# EAGLE schematic microsal (EAGLE 8.2.2)

## Sheet 1 of 2
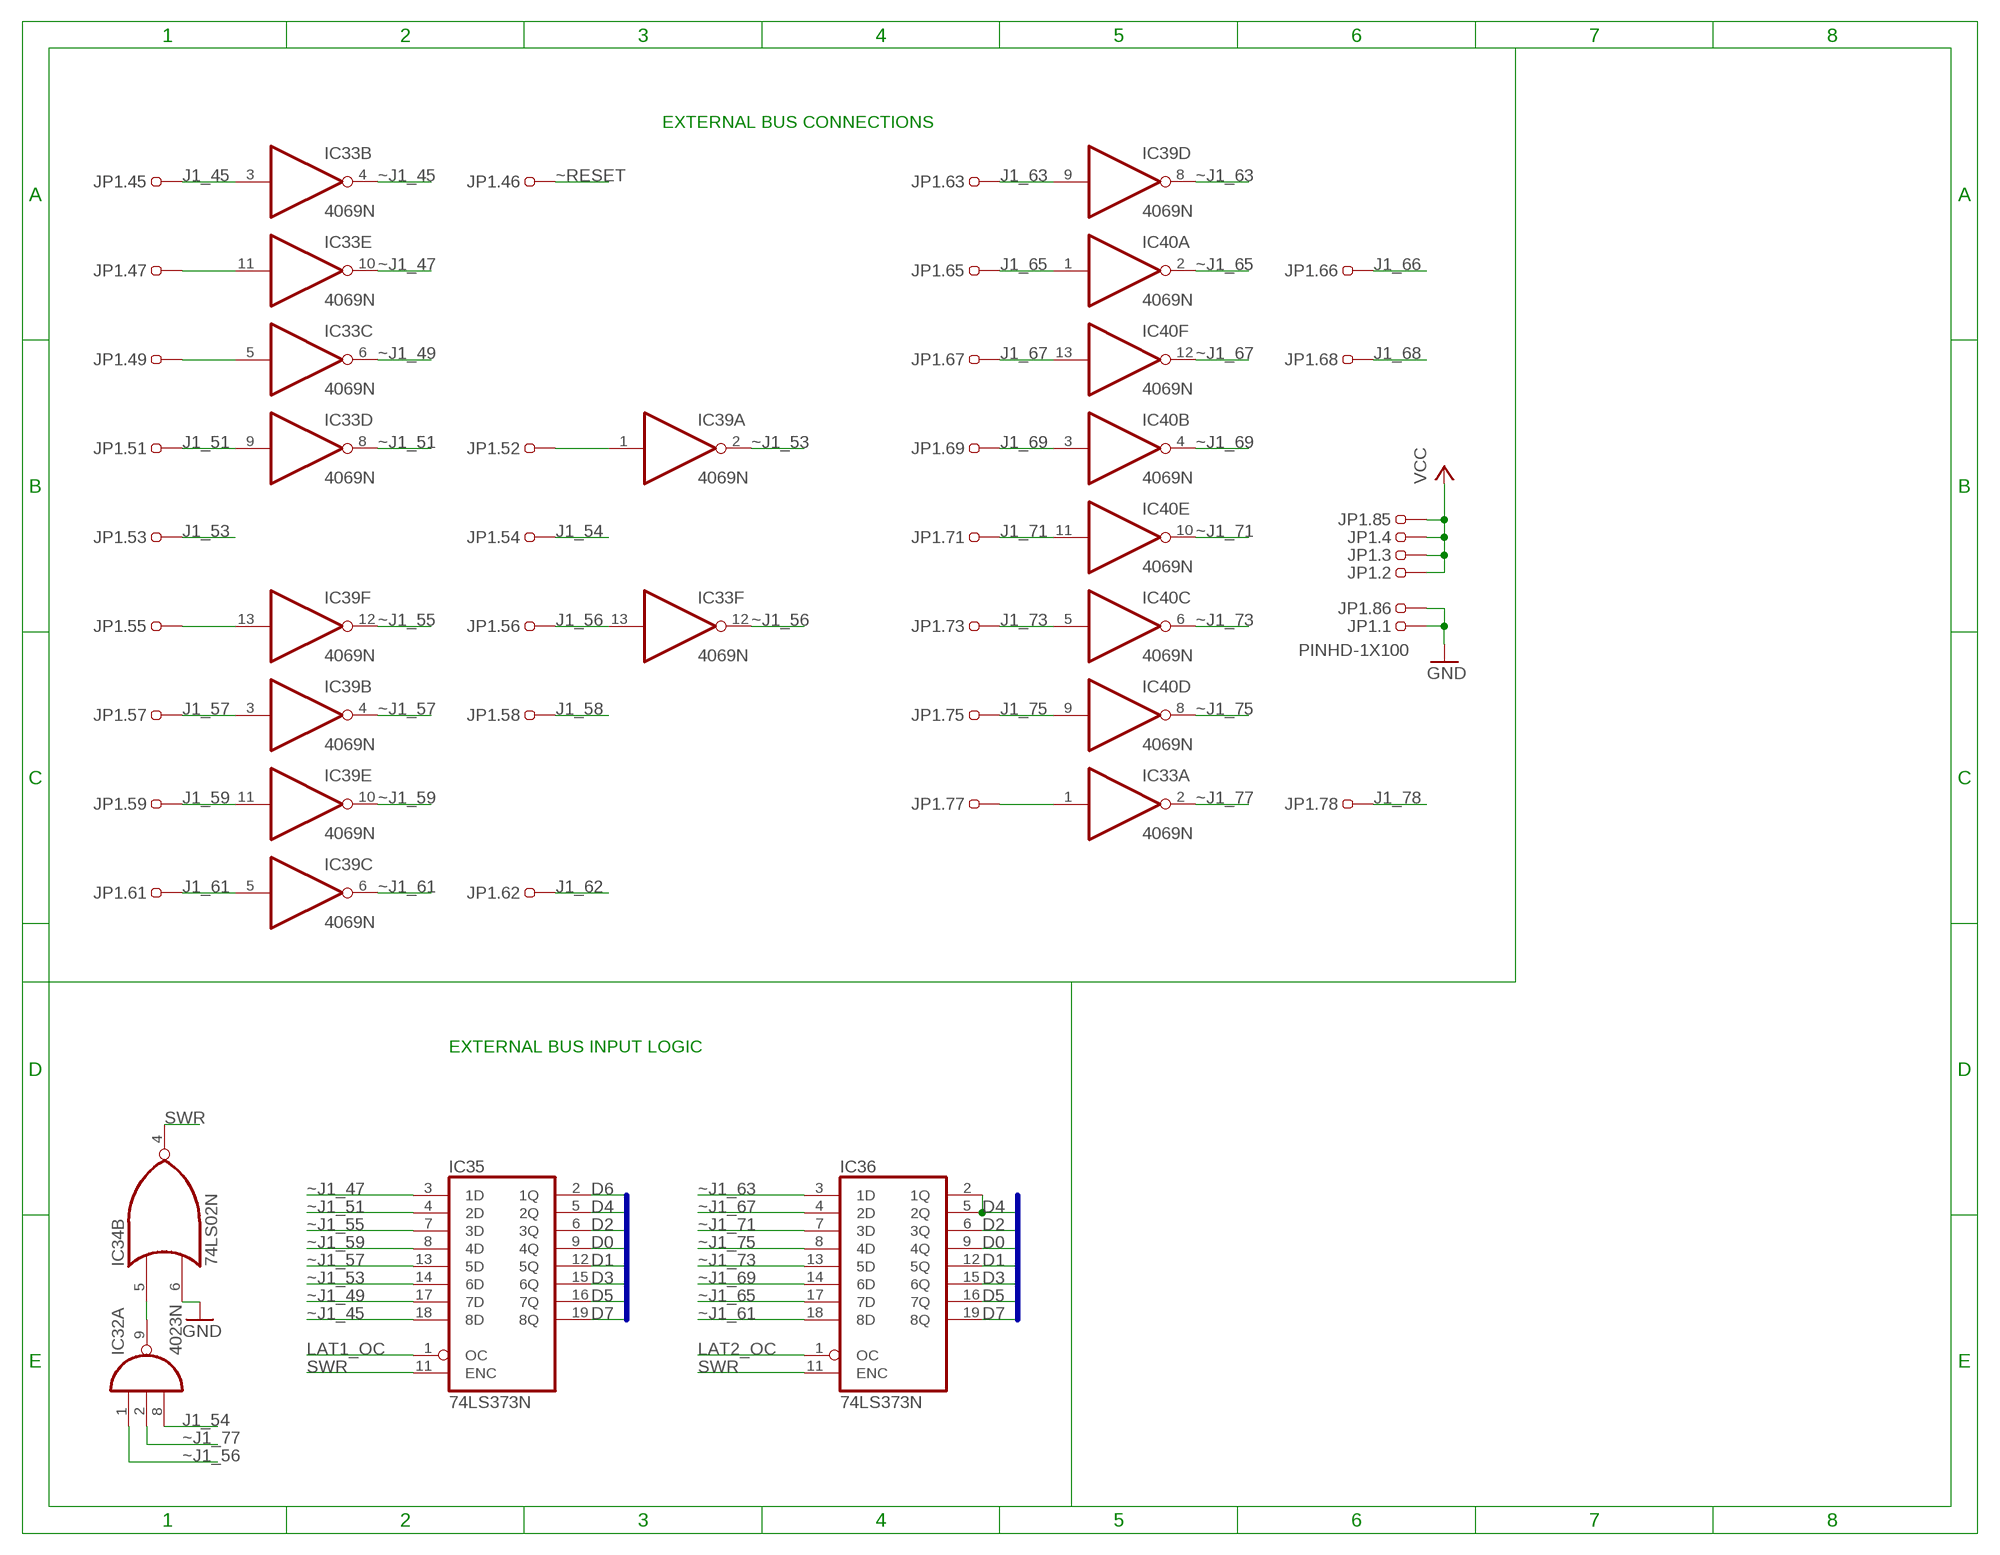
[diagram p0: schematic, sheet 1, part 1 of 2]
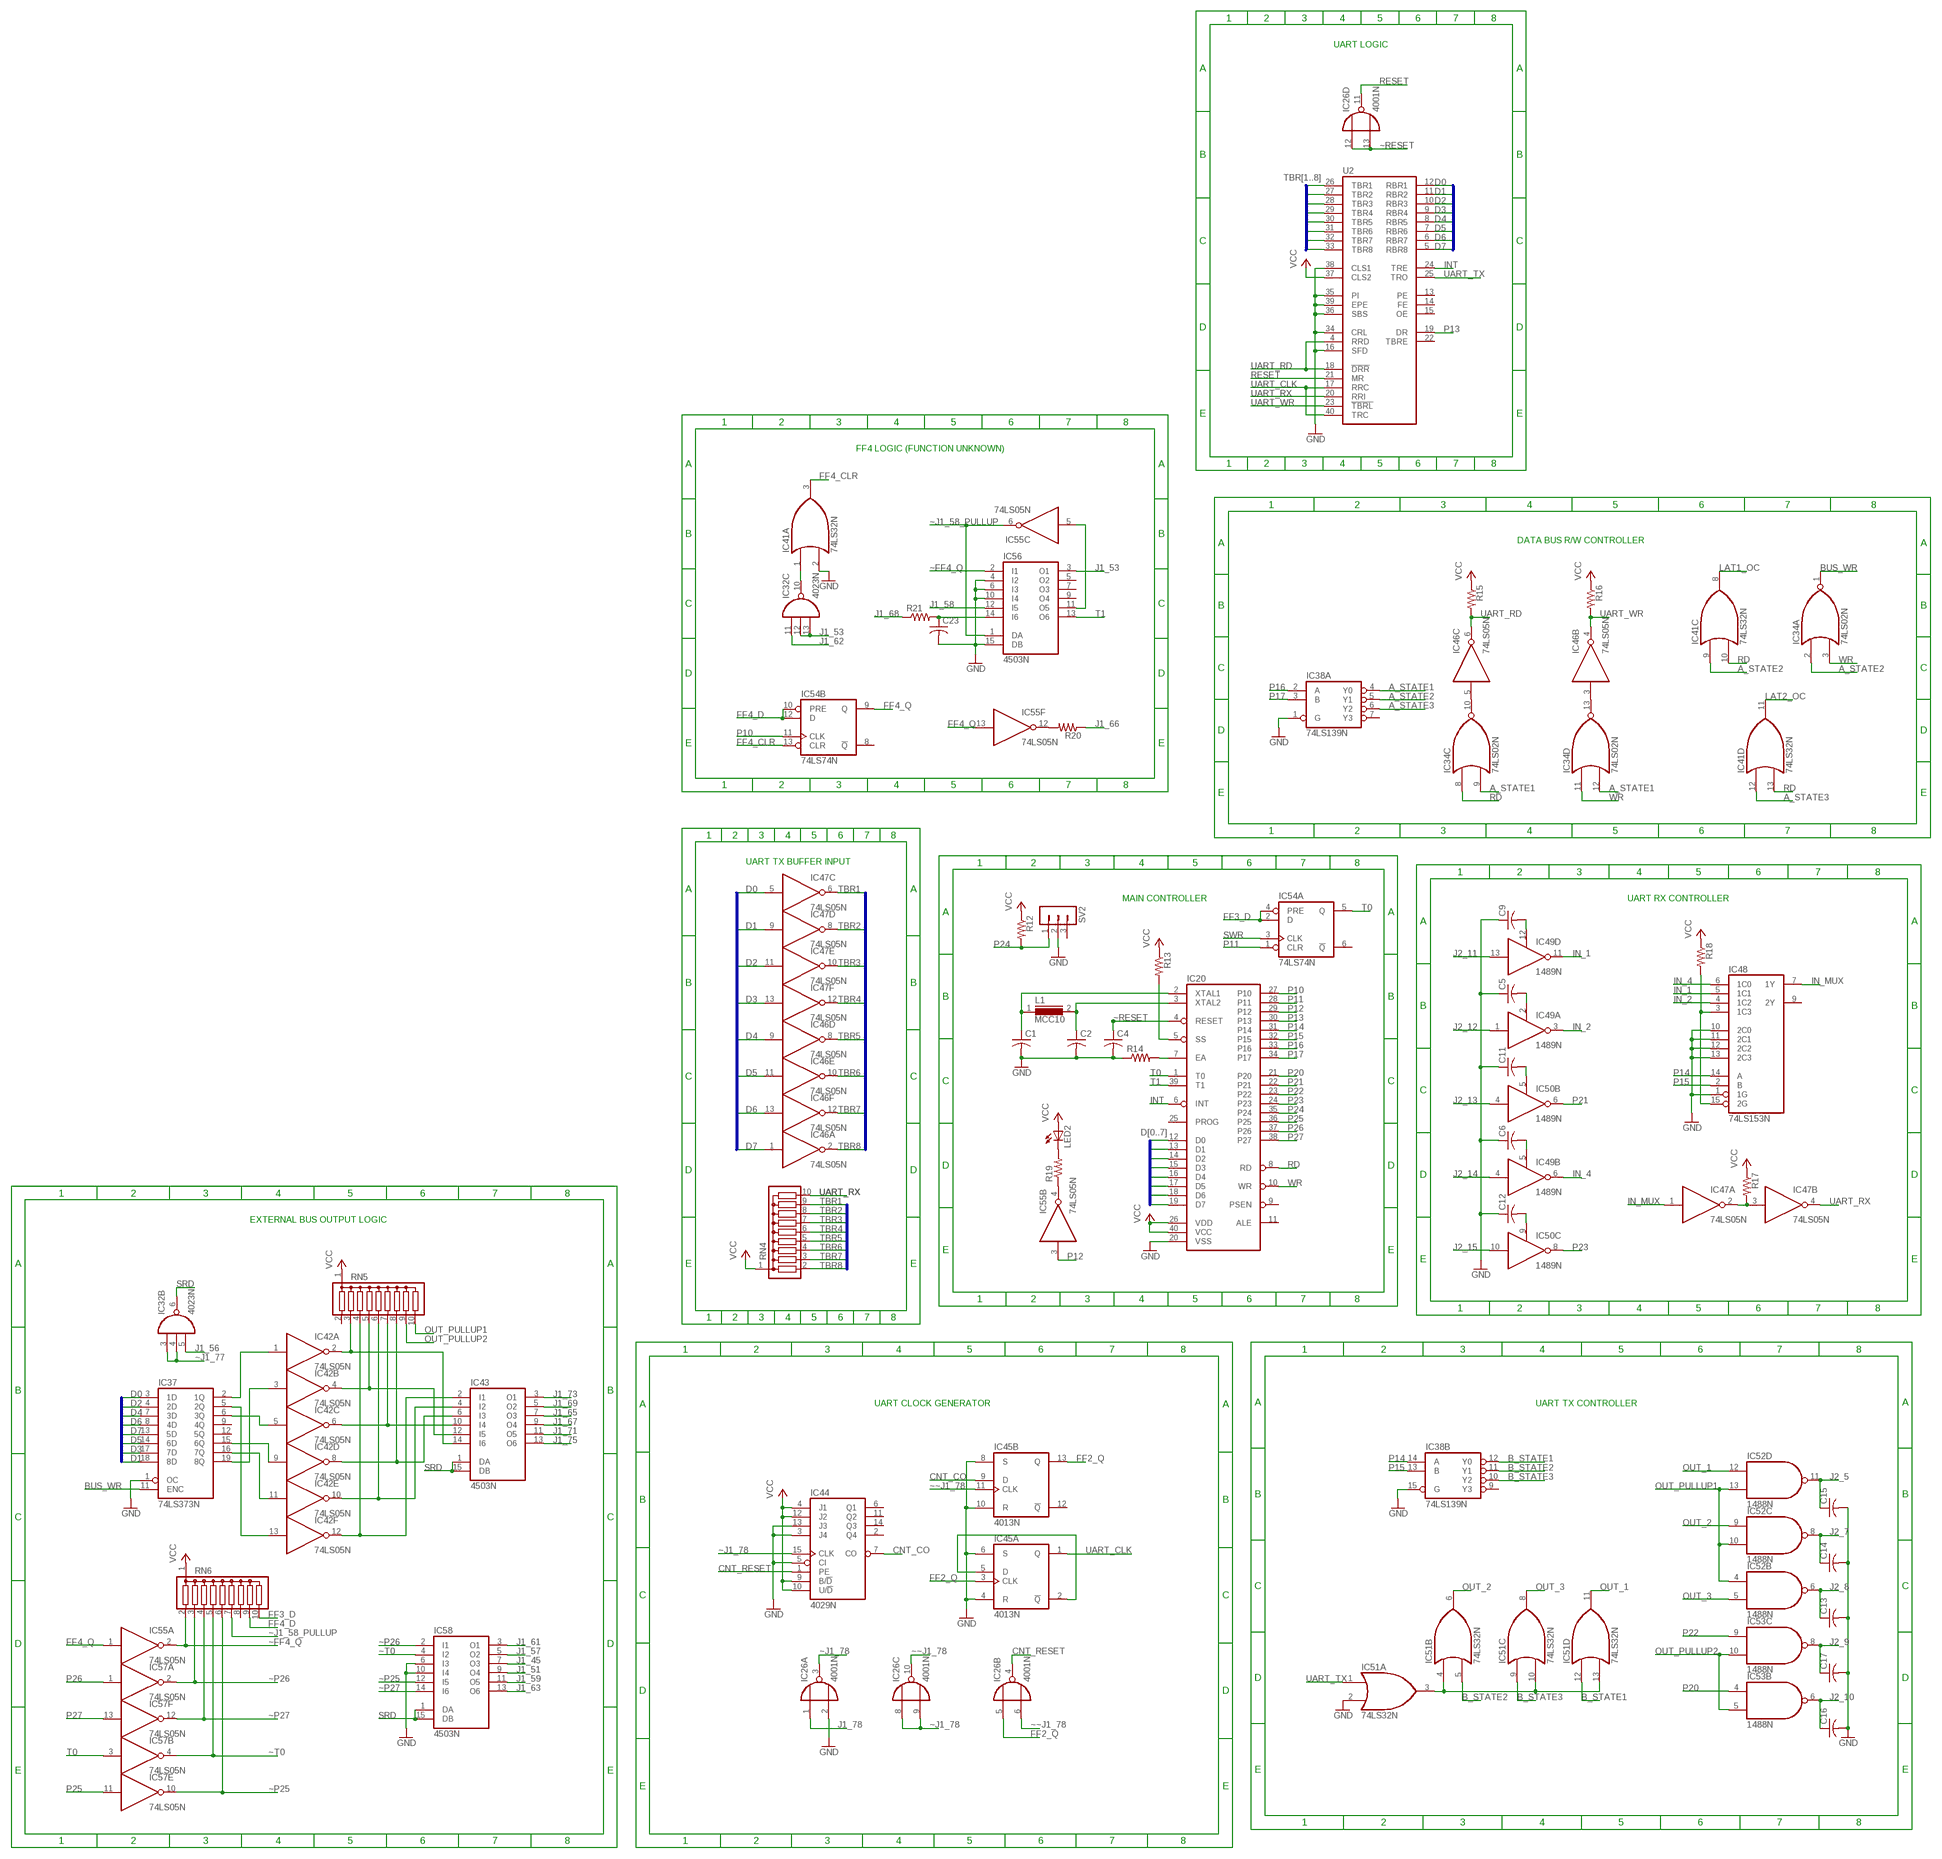
[diagram p1: schematic, sheet 1, part 2 of 2]

### Parts
C1  C-US050-025X075  [C050-025X075]
C2  C-US050-025X075  [C050-025X075]
C4  C-US050-025X075  [C050-025X075]
C5  C-US050-025X075  [C050-025X075]
C6  C-US050-025X075  [C050-025X075]
C9  C-US050-025X075  [C050-025X075]
C11  C-US050-025X075  [C050-025X075]
C12  C-US050-025X075  [C050-025X075]
C13  C-US050-025X075  [C050-025X075]
C14  C-US050-025X075  [C050-025X075]
C15  C-US050-025X075  [C050-025X075]
C16  C-US050-025X075  [C050-025X075]
C17  C-US050-025X075  [C050-025X075]
C23  C-US050-025X075  [C050-025X075]
IC20  8749  [DIL40]
IC26  4001N  [DIL14]
IC32  4023N  [DIL14]
IC33  4069N  [DIL14]
IC34  74LS02N  [DIL14]
IC35  74LS373N  [DIL20]
IC36  74LS373N  [DIL20]
IC37  74LS373N  [DIL20]
IC38  74LS139N  [DIL16]
IC39  4069N  [DIL14]
IC40  4069N  [DIL14]
IC41  74LS32N  [DIL14]
IC42  74LS05N  [DIL14]
IC43  4503N  [DIL16]
IC44  4029N  [DIL16]
IC45  4013N  [DIL14]
IC46  74LS05N  [DIL14]
IC47  74LS05N  [DIL14]
IC48  74LS153N  [DIL16]
IC49  1489N  [DIL14]
IC50  1489N  [DIL14]
IC51  74LS32N  [DIL14]
IC52  1488N  [DIL14]
IC53  1488N  [DIL14]
IC54  74LS74N  [DIL14]
IC55  74LS05N  [DIL14]
IC56  4503N  [DIL16]
IC57  74LS05N  [DIL14]
IC58  4503N  [DIL16]
JP1  PINHD-1X100  [1X100]
L1  MCC10  [MCC10]
LED2  LED5MM  [LED5MM]
R12  R-US_0207/10  [0207/10]
R13  R-US_0207/10  [0207/10]
R14  R-US_0207/10  [0207/10]
R15  R-US_0207/10  [0207/10]
R16  R-US_0207/10  [0207/10]
R17  R-US_0207/10  [0207/10]
R18  R-US_0207/10  [0207/10]
R19  R-US_0207/10  [0207/10]
R20  R-US_0207/10  [0207/10]
R21  R-US_0207/10  [0207/10]
RN4  G09R  [SIL10]
RN5  G09R  [SIL10]
RN6  G09R  [SIL10]
SV2  MA03-1  [MA03-1]
U2  HD6402  [DIL40]

### Nets
A_STATE1: IC34.9(C:I1) IC34.12(D:I1) IC38.4(A:Y0)
A_STATE2: IC34.2(A:I0) IC38.5(A:Y1) IC41.9(C:I0)
A_STATE3: IC38.6(A:Y2) IC41.12(D:I0)
B_STATE1: IC38.12(B:Y0) IC51.12(D:I0)
B_STATE2: IC38.11(B:Y1) IC51.5(B:I1)
B_STATE3: IC38.10(B:Y2) IC51.9(C:I0)
BUS_WR: IC34.1(A:O) IC37.11(ENC)
CNT_CO: IC44.7(CO) IC45.9(B:D)
CNT_RESET: IC26.4(B:O) IC44.1(PE)
D0: IC20.12(D0) IC35.9(4Q) IC36.9(4Q) IC37.3(1D) IC47.5(C:I) U2.12(RBR1)
D1: IC20.13(D1) IC35.12(5Q) IC36.12(5Q) IC37.18(8D) IC47.9(D:I) U2.11(RBR2)
D2: IC20.14(D2) IC35.6(3Q) IC36.6(3Q) IC37.4(2D) IC47.11(E:I) U2.10(RBR3)
D3: IC20.15(D3) IC35.15(6Q) IC36.15(6Q) IC37.17(7D) IC47.13(F:I) U2.9(RBR4)
D4: IC20.16(D4) IC35.5(2Q) IC36.2(1Q) IC36.5(2Q) IC37.7(3D) IC46.9(D:I) U2.8(RBR5)
D5: IC20.17(D5) IC35.16(7Q) IC36.16(7Q) IC37.14(6D) IC46.11(E:I) U2.7(RBR6)
D6: IC20.18(D6) IC35.2(1Q) IC37.8(4D) IC46.13(F:I) U2.6(RBR7)
D7: IC20.19(D7) IC35.19(8Q) IC36.19(8Q) IC37.13(5D) IC46.1(A:I) U2.5(RBR8)
FF2_Q: IC26.5(B:I0) IC45.3(A:CLK) IC45.13(B:Q)
FF3_D: IC54.2(A:D) IC54.4(A:PRE) RN6.10
FF4_CLR: IC41.3(A:O) IC54.13(B:CLR)
FF4_D: IC54.10(B:PRE) IC54.12(B:D) RN6.9
FF4_Q: IC54.9(B:Q) IC55.1(A:I) IC55.13(F:I)
GND: C1.2 C2.2 C4.2 C5.1 C6.1 C9.1 C11.1 C12.1 C13.2 C14.2 C15.2 C16.2 C17.2 C23.2 IC20.20(VSS) IC26.2(A:I1) IC34.6(B:I1) IC37.1(OC) IC38.1(A:G) IC38.15(B:G) IC41.2(A:I1) IC44.3(J4) IC44.5(CI) IC44.13(J3) IC45.4(A:R) IC45.6(A:S) IC45.8(B:S) IC45.10(B:R) IC48.1(1G) IC48.10(2C0) IC48.11(2C1) IC48.12(2C2) IC48.13(2C3) IC51.2(A:I1) IC56.4(I2) IC56.6(I3) IC56.10(I4) IC56.15(DB) IC58.6(I3) IC58.10(I4) JP1.1 JP1.86 R14.1 SV2.2 U2.16(SFD) U2.34(CRL) U2.35(PI) U2.36(SBS) U2.38(CLS1) U2.39(EPE)
IN_1: IC48.5(1C1) IC49.11(D:O)
IN_2: IC48.4(1C2) IC49.3(A:O)
IN_4: IC48.6(1C0) IC49.6(B:O)
IN_MUX: IC47.1(A:I) IC48.7(1Y)
INT: IC20.6(INT) U2.24(TRE)
J1_45: IC33.3(B:I) IC58.7(O3) JP1.45
J1_51: IC33.9(D:I) IC58.9(O4) JP1.51
J1_53: IC32.12(C:I1) IC32.13(C:I2) IC56.3(O1) JP1.53
J1_54: IC32.8(A:I2) JP1.54
J1_56: IC32.5(B:I2) IC33.13(F:I) JP1.56
J1_57: IC39.3(B:I) IC58.5(O2) JP1.57
J1_58: IC56.12(I5) JP1.58
J1_59: IC39.11(E:I) IC58.11(O5) JP1.59
J1_61: IC39.5(C:I) IC58.3(O1) JP1.61
J1_62: IC32.11(C:I0) JP1.62
J1_63: IC39.9(D:I) IC58.13(O6) JP1.63
J1_65: IC40.1(A:I) IC43.7(O3) JP1.65
J1_66: JP1.66 R20.1
J1_67: IC40.13(F:I) IC43.9(O4) JP1.67
J1_68: JP1.68 R21.1
J1_69: IC40.3(B:I) IC43.5(O2) JP1.69
J1_71: IC40.11(E:I) IC43.11(O5) JP1.71
J1_73: IC40.5(C:I) IC43.3(O1) JP1.73
J1_75: IC40.9(D:I) IC43.13(O6) JP1.75
J1_78: IC26.1(A:I0) JP1.78
J2_5: C15.1 IC52.11(D:O)
J2_7: C14.1 IC52.8(C:O)
J2_8: C13.1 IC52.6(B:O)
J2_9: C17.1 IC53.8(C:O)
J2_10: C16.1 IC53.6(B:O)
J2_11: IC49.13(D:I)
J2_12: IC49.1(A:I)
J2_13: IC50.4(B:I)
J2_14: IC49.4(B:I)
J2_15: IC50.10(C:I)
LAT1_OC: IC35.1(OC) IC41.8(C:O)
LAT2_OC: IC36.1(OC) IC41.11(D:O)
N$88: IC45.2(A:!Q) IC45.5(A:D)
N$99: C1.1 IC20.2(XTAL1) L1.1
N$106: IC32.10(C:O) IC41.1(A:I0)
N$127: IC20.5(SS) R13.2
N$128: C2.1 IC20.3(XTAL2) L1.2
N$129: IC20.7(EA) R14.2
N$130: IC33.1(A:I) JP1.77
N$131: IC34.10(C:O) IC46.5(C:I)
N$132: IC32.9(A:O) IC34.5(B:I0)
N$133: IC33.11(E:I) JP1.47
N$135: IC39.13(F:I) JP1.55
N$138: IC39.1(A:I) JP1.52
N$139: IC33.5(C:I) JP1.49
N$142: IC34.13(D:O) IC46.3(B:I)
N$143: IC47.2(A:O) IC47.3(B:I) R17.2
N$144: C5.2 IC49.2(A:RC)
N$145: C6.2 IC49.5(B:RC)
N$146: C11.2 IC50.5(B:RC)
N$147: C9.2 IC49.12(D:RC)
N$149: IC37.2(1Q) IC42.1(A:I)
N$150: IC37.5(2Q) IC42.13(F:I)
N$151: IC37.6(3Q) IC42.5(C:I)
N$152: IC37.15(6Q) IC42.9(D:I)
N$153: IC37.16(7Q) IC42.11(E:I)
N$154: IC37.19(8Q) IC42.3(B:I)
N$155: IC42.2(A:O) IC43.14(I6) RN5.3
N$156: IC42.4(B:O) IC43.12(I5) RN5.5
N$157: IC42.6(C:O) IC43.10(I4) RN5.7
N$158: IC42.8(D:O) IC43.6(I3) RN5.8
N$159: IC42.10(E:O) IC43.4(I2) RN5.6
N$160: IC42.12(F:O) IC43.2(I1) RN5.4
N$161: C12.2 IC50.9(C:RC)
N$162: IC51.3(A:O) IC51.4(B:I0) IC51.10(C:I1) IC51.13(D:I1)
N$165: LED2.K(C) R19.2
N$166: IC55.4(B:O) R19.1
N$168: IC55.12(F:O) R20.2
N$169: C23.1 IC56.14(I6) R21.2
N$170: IC48.3(1C3) IC48.15(2G) R18.2
N$171: IC55.5(C:I) IC56.11(O5)
OUT_1: IC51.11(D:O) IC52.12(D:I0)
OUT_2: IC51.6(B:O) IC52.9(C:I0)
OUT_3: IC51.8(C:O) IC52.5(B:I1)
OUT_PULLUP1: IC52.4(B:I0) IC52.10(C:I1) IC52.13(D:I1) RN5.10
OUT_PULLUP2: IC53.5(B:I1) IC53.10(C:I1) RN5.9
P10: IC20.27(P10) IC54.11(B:CLK)
P11: IC20.28(P11) IC54.1(A:CLR)
P12: IC20.29(P12) IC55.3(B:I)
P13: IC20.30(P13) U2.19(DR)
P14: IC20.31(P14) IC38.14(B:A) IC48.14(A)
P15: IC20.32(P15) IC38.13(B:B) IC48.2(B)
P16: IC20.33(P16) IC38.2(A:A)
P17: IC20.34(P17) IC38.3(A:B)
P20: IC20.21(P20) IC53.4(B:I0)
P21: IC20.22(P21) IC50.6(B:O)
P22: IC20.23(P22) IC53.9(C:I0)
P23: IC20.24(P23) IC50.8(C:O)
P24: IC20.35(P24) R12.2 SV2.1
P25: IC20.36(P25) IC57.11(E:I)
P26: IC20.37(P26) IC57.1(A:I)
P27: IC20.38(P27) IC57.13(F:I)
RD: IC20.8(RD) IC34.8(C:I0) IC41.10(C:I1) IC41.13(D:I1)
RESET: IC26.11(D:O) U2.21(MR)
SRD: IC32.6(B:O) IC43.1(DA) IC43.15(DB) IC58.1(DA) IC58.15(DB)
SWR: IC34.4(B:O) IC35.11(ENC) IC36.11(ENC) IC54.3(A:CLK)
T0: IC20.1(T0) IC54.5(A:Q) IC57.3(B:I)
T1: IC20.39(T1) IC56.13(O6)
TBR1: IC47.6(C:O) RN4.9 U2.26(TBR1)
TBR2: IC47.8(D:O) RN4.8 U2.27(TBR2)
TBR3: IC47.10(E:O) RN4.7 U2.28(TBR3)
TBR4: IC47.12(F:O) RN4.6 U2.29(TBR4)
TBR5: IC46.8(D:O) RN4.5 U2.30(TBR5)
TBR6: IC46.10(E:O) RN4.4 U2.31(TBR6)
TBR7: IC46.12(F:O) RN4.3 U2.32(TBR7)
TBR8: IC46.2(A:O) RN4.2 U2.33(TBR8)
UART_CLK: IC45.1(A:Q) U2.17(RRC) U2.40(TRC)
UART_RD: IC46.6(C:O) R15.2 U2.4(RRD) U2.18(!DRR)
UART_RX: IC47.4(B:O) RN4.10 U2.20(RRI)
UART_TX: IC51.1(A:I0) U2.25(TRO)
UART_WR: IC46.4(B:O) R16.2 U2.23(!TBRL)
VCC: IC20.26(VDD) IC20.40(VCC) IC44.4(J1) IC44.9(B/!D) IC44.10(U/!D) IC44.12(J2) JP1.2 JP1.3 JP1.4 JP1.85 LED2.A R12.1 R13.1 R15.1 R16.1 R17.1 R18.1 RN4.1 RN5.1 RN6.1 U2.37(CLS2)
WR: IC20.10(WR) IC34.3(A:I1) IC34.11(D:I0)
~FF4_Q: IC55.2(A:O) IC56.2(I1) RN6.2
~J1_45: IC33.4(B:O) IC35.18(8D)
~J1_47: IC33.10(E:O) IC35.3(1D)
~J1_49: IC33.6(C:O) IC35.17(7D)
~J1_51: IC33.8(D:O) IC35.4(2D)
~J1_53: IC35.14(6D) IC39.2(A:O)
~J1_55: IC35.7(3D) IC39.12(F:O)
~J1_56: IC32.1(A:I0) IC33.12(F:O)
~J1_57: IC35.13(5D) IC39.4(B:O)
~J1_58_PULLUP: IC55.6(C:O) IC56.1(DA) RN6.7
~J1_59: IC35.8(4D) IC39.10(E:O)
~J1_61: IC36.18(8D) IC39.6(C:O)
~J1_63: IC36.3(1D) IC39.8(D:O)
~J1_65: IC36.17(7D) IC40.2(A:O)
~J1_67: IC36.4(2D) IC40.12(F:O)
~J1_69: IC36.14(6D) IC40.4(B:O)
~J1_71: IC36.7(3D) IC40.10(E:O)
~J1_73: IC36.13(5D) IC40.6(C:O)
~J1_75: IC36.8(4D) IC40.8(D:O)
~J1_77: IC32.2(A:I1) IC32.3(B:I0) IC32.4(B:I1) IC33.2(A:O)
~J1_78: IC26.3(A:O) IC26.8(C:I0) IC26.9(C:I1) IC44.15(CLK)
~P25: IC57.10(E:O) IC58.12(I5) RN6.6
~P26: IC57.2(A:O) IC58.2(I1) RN6.3
~P27: IC57.12(F:O) IC58.14(I6) RN6.4
~RESET: C4.1 IC20.4(RESET) IC26.12(D:I0) IC26.13(D:I1) JP1.46
~T0: IC57.4(B:O) IC58.4(I2) RN6.5
~~J1_78: IC26.6(B:I1) IC26.10(C:O) IC45.11(B:CLK)
Unconnected: IC20.9(PSEN) IC20.11(ALE) IC20.25(PROG) IC37.9(4Q) IC37.12(5Q) IC38.7(A:Y3) IC38.9(B:Y3) IC41.4(B:I0) IC41.5(B:I1) IC41.6(B:O) IC44.2(Q4) IC44.6(Q1) IC44.11(Q2) IC44.14(Q3) IC45.12(B:!Q) IC48.9(2Y) IC49.8(C:O) IC49.9(C:RC) IC49.10(C:I) IC50.1(A:I) IC50.2(A:RC) IC50.3(A:O) IC50.11(D:O) IC50.12(D:RC) IC50.13(D:I) IC52.2(A:I) IC52.3(A:O) IC53.2(A:I) IC53.3(A:O) IC53.11(D:O) IC53.12(D:I0) IC53.13(D:I1) IC54.6(A:!Q) IC54.8(B:!Q) IC55.8(D:O) IC55.9(D:I) IC55.10(E:O) IC55.11(E:I) IC56.5(O2) IC56.7(O3) IC56.9(O4) IC57.5(C:I) IC57.6(C:O) IC57.8(D:O) IC57.9(D:I) JP1.5 JP1.6 JP1.7 JP1.8 JP1.9 JP1.10 JP1.11 JP1.12 JP1.13 JP1.14 JP1.15 JP1.16 JP1.17 JP1.18 JP1.19 JP1.20 JP1.21 JP1.22 JP1.23 JP1.24 JP1.25 JP1.26 JP1.27 JP1.28 JP1.29 JP1.30 JP1.31 JP1.32 JP1.33 JP1.34 JP1.35 JP1.36 JP1.37 JP1.38 JP1.39 JP1.40 JP1.41 JP1.42 JP1.43 JP1.44 JP1.48 JP1.50 JP1.60 JP1.64 JP1.70 JP1.72 JP1.74 JP1.76 JP1.79 JP1.80 JP1.81 JP1.82 JP1.83 JP1.84 JP1.87 JP1.88 JP1.89 JP1.90 JP1.91 JP1.92 JP1.93 JP1.94 JP1.95 JP1.96 JP1.97 JP1.98 JP1.99 JP1.100 RN5.2 RN6.8 SV2.3 U2.13(PE) U2.14(FE) U2.15(OE) U2.22(TBRE)

### Buses
D[0..7]
TBR[1..8]

### Notes on the sheet
- UART LOGIC
- FF4 LOGIC (FUNCTION UNKNOWN)
- DATA BUS R/W CONTROLLER
- UART TX BUFFER INPUT
- MAIN CONTROLLER | UART RX CONTROLLER
- EXTERNAL BUS CONNECTIONS
- EXTERNAL BUS OUTPUT LOGIC
- UART CLOCK GENERATOR | UART TX CONTROLLER
- EXTERNAL BUS INPUT LOGIC

## Sheet 2 of 2

## Power pins joined to a net without a drawn wire
+12V: IC52.14(P:+12V) IC53.14(P:+12V)
-12V: IC52.1(P:-12V) IC53.1(P:-12V)
GND: IC34.7(P:GND) IC35.10(GND) IC36.10(GND) IC37.10(GND) IC38.8(P:GND) IC41.7(P:GND) IC42.7(P:GND) IC46.7(P:GND) IC47.7(P:GND) IC48.8(GND) IC49.7(P:GND) IC50.7(P:GND) IC51.7(P:GND) IC52.7(P:GND) IC53.7(P:GND) IC54.7(P:GND) IC55.7(P:GND) IC57.7(P:GND) U2.3(GND)
VCC: IC34.14(P:VCC) IC35.20(VCC) IC36.20(VCC) IC37.20(VCC) IC38.16(P:VCC) IC41.14(P:VCC) IC42.14(P:VCC) IC46.14(P:VCC) IC47.14(P:VCC) IC48.16(VCC) IC49.14(P:VCC) IC50.14(P:VCC) IC51.14(P:VCC) IC54.14(P:VCC) IC55.14(P:VCC) IC57.14(P:VCC) U2.1(VCC)
VDD: IC26.14(P:VDD) IC32.14(P:VDD) IC33.14(P:VDD) IC39.14(P:VDD) IC40.14(P:VDD) IC43.16(VDD) IC44.16(VDD) IC45.14(P:VDD) IC56.16(VDD) IC58.16(VDD)
VSS: IC26.7(P:VSS) IC32.7(P:VSS) IC33.7(P:VSS) IC39.7(P:VSS) IC40.7(P:VSS) IC43.8(VSS) IC44.8(VSS) IC45.7(P:VSS) IC56.8(VSS) IC58.8(VSS)

## Library data of the parts
C1 C2 C4-C6 C9 C11-C17 C23 = resistor:C-US: CAPACITOR, American symbol
IC20 = micro-intel:8749: MICROCOMPUTER/PERIPHERAL DEVICE; OC_FARNELL: unknown; OC_NEWARK: unknown
IC26 = 40xx:4001: Quad 2-input NOR
IC32 = 40xx:4023: Triple 3-input NAND
IC33 IC39 IC40 = 40xx:4069: Hex INVERTER
IC34 = 74xx-us:74*02: Quad 2-input NOR gate
IC35-IC37 = 74xx-us:74*373: Octal D type transparent LATCH, edge triggered
IC38 = 74xx-us:74*139: Dual 2-line to 4-line DECODER/DEMULTIPLEXER
IC41 IC51 = 74xx-us:74*32: Quad 2-input OR gate
IC42 IC46 IC47 IC55 IC57 = 74xx-us:74*05: Hex INVERTER, open collector
IC43 IC56 IC58 = 45xx:4503: Tri-state hex BUFFER, 74C367, 80C97
IC44 = 40xx:4029: Binary/decimal up/down COUNTER
IC45 = 40xx:4013: Dual D FLIP FLOP, set/reset
IC48 = 74xx-us:74*153: Dual 4-line to 1-line data SELECTOR/MULTIPLEXER
IC49 IC50 = interface:14*89: Quad line receivers BUFFER,
IC52 IC53 = interface:14*88: Quad 2-input NAND gate
IC54 = 74xx-us:74*74: Dual D type positive edge triggered FLIP FLOP, preset and clear
JP1 = pinhead:PINHD-1X100: PIN HEADER 100 pol. Grid 2.54mm
L1 = inductors:MCC10: INDUCTOR
LED2 = led:LED: LED OSRAM: - CHIPLED LG R971, LG N971, LY N971, LG Q971, LY Q971, LO R971, LY R971 LH N974, LH R974 LS Q976, LO Q976, LY Q976 LO Q996 - Hyper CHIPLED LW Q18S LB Q993, LB Q99A, LB R99A - SideLED LS A670, LO A670, LY A670, LG A670, LP A670 LB A673, LV A673, LT A673, LW A673 LH A674 LY A675 LS A676, LA A676, LO A676, LY A676, LW A676 LS A679, LY A679, LG A679 - Hyper Micro SIDELED® LS Y876, LA Y876, LO Y876, LY Y876 LT Y87S - SmartLED LW L88C, LW L88S LB L89C, LB L89S, LG L890 LS L89K, LO L89K, LY L89K LS L896, LA L896, LO L896, LY L896 - TOPLED LS T670, LO T670, LY T670, LG T670, LP T670 LSG T670, LSP T670, LSY T670, LOP T670, LYG T670 LG T671, LOG T671, LSG T671 LB T673, LV T673, LT T673, LW T673 LH T674 LS T676, LA T676, LO T676, LY T676, LB T676, LH T676, LSB T676, LW T676 LB T67C, LV T67C, LT T67C, LS T67K, LO T67K, LY T67K, LW E67C LS E67B, LA E67B, LO E67B, LY E67B, LB E67C, LV E67C, LT E67C LW T67C LS T679, LY T679, LG T679 LS T770, LO T770, LY T770, LG T770, LP T770 LB T773, LV T773, LT T773, LW T773 LH T774 LS E675, LA E675, LY E675, LS T675 LS T776, LA T776, LO T776, LY T776, LB T776 LHGB T686 LT T68C, LB T68C - Hyper Mini TOPLED® LB M676 - Mini TOPLED Santana® LG M470 LS M47K, LO M47K, LY M47K Source: http://www.osram.convergy.de LUXEON: - LUMILED® LXK2-PW12-R00, LXK2-PW12-S00, LXK2-PW14-U00, LXK2-PW14-V00 LXK2-PM12-R00, LXK2-PM12-S00, LXK2-PM14-U00 LXK2-PE12-Q00, LXK2-PE12-R00, LXK2-PE12-S00, LXK2-PE14-T00, LXK2-PE14-U00 LXK2-PB12-K00, LXK2-PB12-L00, LXK2-PB12-M00, LXK2-PB14-N00, LXK2-PB14-P00, LXK2-PB14-Q00 LXK2-PR12-L00, LXK2-PR12-M00, LXK2-PR14-Q00, LXK2-PR14-R00 LXK2-PD12-Q00, LXK2-PD12-R00, LXK2-PD12-S00 LXK2-PH12-R00, LXK2-PH12-S00 LXK2-PL12-P00, LXK2-PL12-Q00, LXK2-PL12-R00 Source: www.luxeon.com KINGBRIGHT: KA-3528ASYC Source: www.kingbright.com
R12-R21 = resistor:R-US_: RESISTOR, American symbol
RN4-RN6 = resistor-sil:G09R: SIL RESISTOR; OC_FARNELL: unknown; OC_NEWARK: unknown
SV2 = con-lstb:MA03-1: PIN HEADER; OC_FARNELL: unknown; OC_NEWARK: unknown
U2 = micro-harris:HD6402: MICROCONTROLLER/MEMORY DEVICE; OC_FARNELL: unknown; OC_NEWARK: unknown